# Altium project PCB_Project.PrjPcb
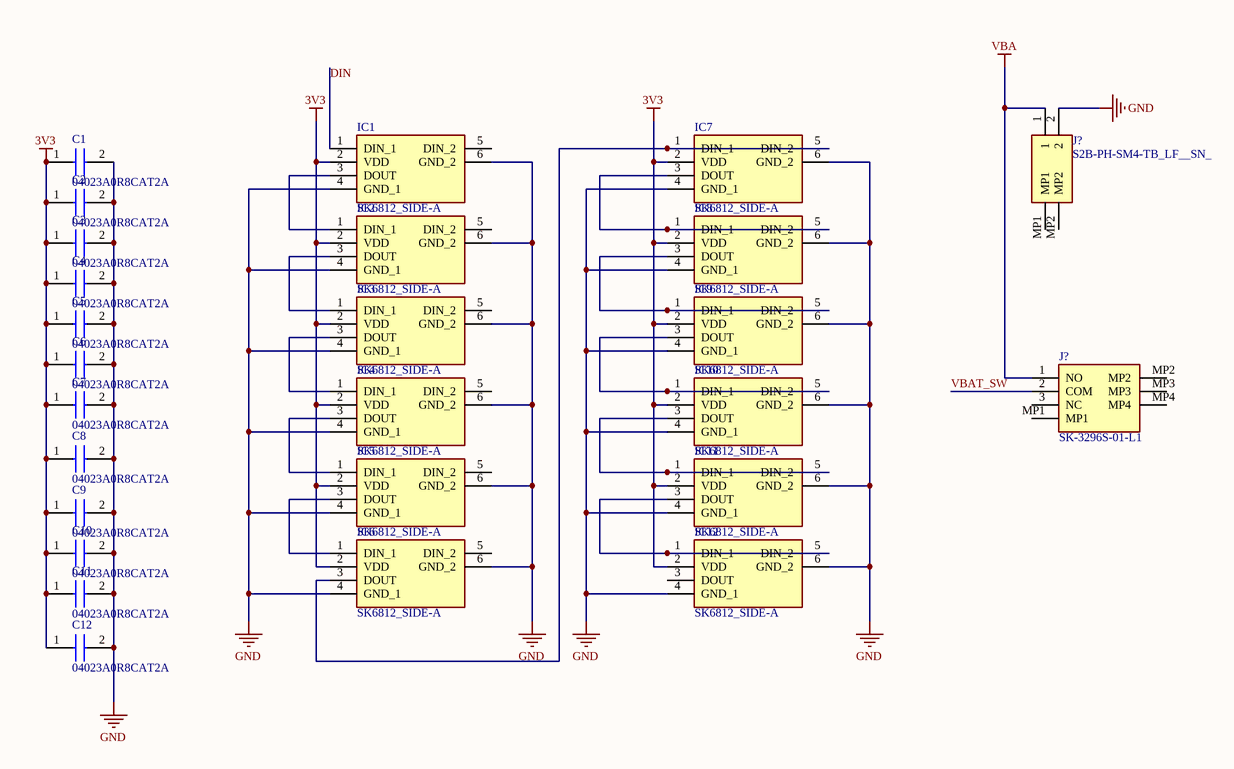
[diagram p0: BurnerFinder.SchDoc]
1 sheet, 26 parts. Net scope: global (net labels, ports and power ports of the same name join across sheets).
Board file: BurnerFinderMkI.PcbDoc

## Sheet BurnerFinder.SchDoc
size A4; SheetNumber: 1; SheetTotal: 1

### Parts
(Parts that share a designator on the sheet are numbered #1, #2 ... from top to bottom, then left to right.)
C1  04023A0R8CAT2A  [CAPC1005X56N]
C2  04023A0R8CAT2A  [CAPC1005X56N]
C3  04023A0R8CAT2A  [CAPC1005X56N]
C4  04023A0R8CAT2A  [CAPC1005X56N]
C5  04023A0R8CAT2A  [CAPC1005X56N]
C6  04023A0R8CAT2A  [CAPC1005X56N]
C7  04023A0R8CAT2A  [CAPC1005X56N]
C8  04023A0R8CAT2A  [CAPC1005X56N]
C9  04023A0R8CAT2A  [CAPC1005X56N]
C10  04023A0R8CAT2A  [CAPC1005X56N]
C11  04023A0R8CAT2A  [CAPC1005X56N]
C12  04023A0R8CAT2A  [CAPC1005X56N]
IC1  SK6812_SIDE-A  [SK6812SIDEA]
IC2  SK6812_SIDE-A  [SK6812SIDEA]
IC3  SK6812_SIDE-A  [SK6812SIDEA]
IC4  SK6812_SIDE-A  [SK6812SIDEA]
IC5  SK6812_SIDE-A  [SK6812SIDEA]
IC6  SK6812_SIDE-A  [SK6812SIDEA]
IC7  SK6812_SIDE-A  [SK6812SIDEA]
IC8  SK6812_SIDE-A  [SK6812SIDEA]
IC9  SK6812_SIDE-A  [SK6812SIDEA]
IC10  SK6812_SIDE-A  [SK6812SIDEA]
IC11  SK6812_SIDE-A  [SK6812SIDEA]
IC12  SK6812_SIDE-A  [SK6812SIDEA]
J?#1  S2B-PH-SM4-TB_LF__SN_  [S2BPHSM4TBLFSN]
J?#2  SK-3296S-01-L1  [SK3296S01L1]

### Nets
3V3: C1.1 C2.1 C3.1 C4.1 C5.1 C6.1 C7.1 C8.1 C9.1 C10.1 C11.1 C12.1 IC1.2(VDD) IC2.2(VDD) IC3.2(VDD) IC4.2(VDD) IC5.2(VDD) IC6.2(VDD) IC7.2(VDD) IC8.2(VDD) IC9.2(VDD) IC10.2(VDD) IC11.2(VDD) IC12.2(VDD)
GND: C1.2 C2.2 C3.2 C4.2 C5.2 C6.2 C7.2 C8.2 C9.2 C10.2 C11.2 C12.2 IC1.4(GND_1) IC1.6(GND_2) IC2.4(GND_1) IC2.6(GND_2) IC3.4(GND_1) IC3.6(GND_2) IC4.4(GND_1) IC4.6(GND_2) IC5.4(GND_1) IC5.6(GND_2) IC6.4(GND_1) IC6.6(GND_2) IC7.4(GND_1) IC7.6(GND_2) IC8.4(GND_1) IC8.6(GND_2) IC9.4(GND_1) IC9.6(GND_2) IC10.4(GND_1) IC10.6(GND_2) IC11.4(GND_1) IC11.6(GND_2) IC12.4(GND_1) IC12.6(GND_2) J?#1.2
VBA: J?#1.1 J?#2.1(NO)
DIN: IC1.1(DIN_1)
VBAT_SW: J?#2.2(COM)
NetIC1_3: IC1.3(DOUT) IC2.1(DIN_1)
NetIC2_3: IC2.3(DOUT) IC3.1(DIN_1)
NetIC3_3: IC3.3(DOUT) IC4.1(DIN_1)
NetIC4_3: IC4.3(DOUT) IC5.1(DIN_1)
NetIC5_3: IC5.3(DOUT) IC6.1(DIN_1)
NetIC6_3: IC6.3(DOUT) IC7.1(DIN_1) IC7.5(DIN_2)
NetIC7_3: IC7.3(DOUT) IC8.1(DIN_1) IC8.5(DIN_2)
NetIC8_3: IC8.3(DOUT) IC9.1(DIN_1) IC9.5(DIN_2)
NetIC9_3: IC9.3(DOUT) IC10.1(DIN_1) IC10.5(DIN_2)
NetIC10_3: IC10.3(DOUT) IC11.1(DIN_1) IC11.5(DIN_2)
NetIC11_3: IC11.3(DOUT) IC12.1(DIN_1) IC12.5(DIN_2)

Not connected (* = marked no-connect by the designer): IC1 5(DIN_2); IC2 5(DIN_2); IC3 5(DIN_2); IC4 5(DIN_2); IC5 5(DIN_2); IC6 5(DIN_2); IC12 3(DOUT); J?#1 MP1 MP2; J?#2 3(NC) MP1 MP2 MP3 MP4

### Library data of the parts
C1-C12 = 04023A0R8CAT2A: Capacitor; Manufacturer_Name: AVX; Datasheet Link: http://www.mouser.com/catalog/supplier/library/pdf/AVXSurfaceMountCeramic.pdf; Height: 0.56mm; Manufacturer_Part_Number: 04023A0R8CAT2A; Mouser Part Number: 581-04023A0R8CAT2A; Mouser Price/Stock: https://www.mouser.co.uk/ProductDetail/AVX/04023A0R8CAT2A?qs=ZwvTZoB9SO%252BVBOZ%252BNMbjzw%3D%3D
IC1-IC12 = SK6812_SIDE-A: Integrated Circuit; Manufacturer_Name: Shenzhen Normand Electronic; Manufacturer_Part_Number: SK6812 SIDE-A; Datasheet Link: http://www.normandled.com/upload/201810/SK6812%20SIDE-A%20LED%20Datasheet.pdf; Height: 2.05mm
J?#1 = S2B-PH-SM4-TB_LF__SN_: Connector; Manufacturer_Name: JST (JAPAN SOLDERLESS TERMINALS); Manufacturer_Part_Number: S2B-PH-SM4-TB(LF)(SN); Datasheet Link: https://www.jst-mfg.com/product/pdf/eng/ePH.pdf; Height: 6.6mm; Arrow Part Number: S2B-PH-SM4-TB(LF)(SN); Arrow Price/Stock: https://www.arrow.com/en/products/s2b-ph-sm4-tb-lf-sn/jst-manufacturing?region=europe
J?#2 = SK-3296S-01-L1: Connector; Manufacturer_Name: XKB Connectivity; Datasheet Link: https://datasheet.lcsc.com/szlcsc/XKB-SK-3296S-01-L1_C319020.pdf; Height: 1.4mm; Manufacturer_Part_Number: SK-3296S-01-L1